# Altium schematic sheet Display.SchDoc: Display
size A4; SheetNumber: 4; SheetTotal: 5
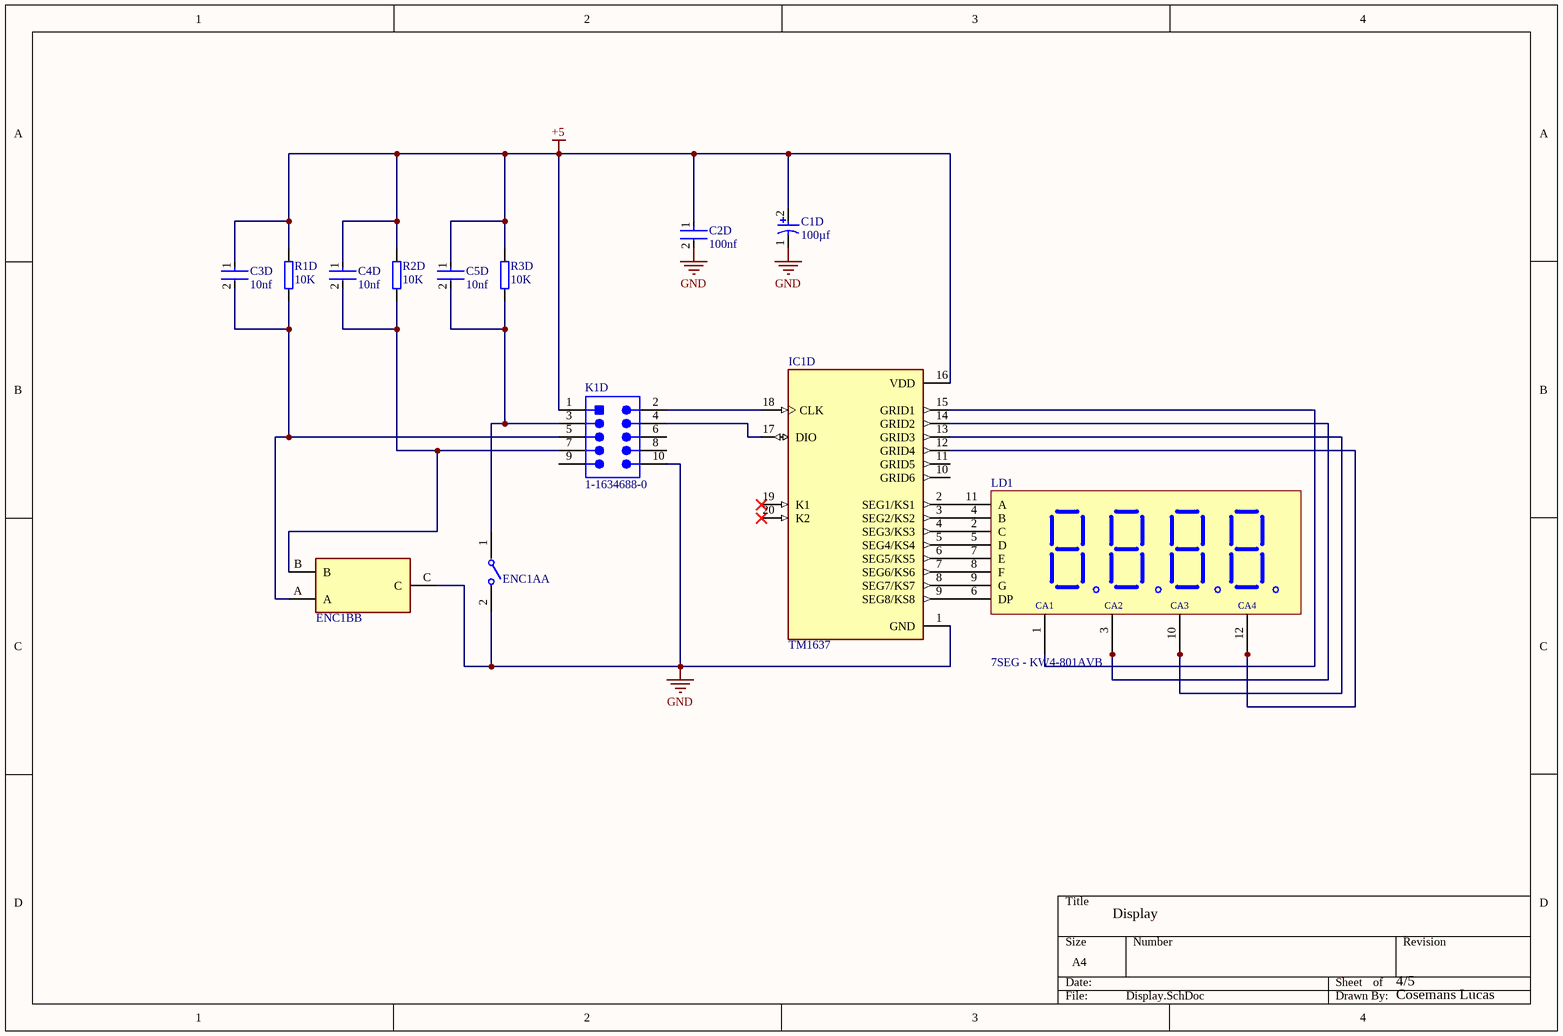
[diagram p0: Display.SchDoc]

## Parts
C1D  100µf  [CE_D6,3_L4,5]
C2D  100nf  [CC_0805_L]
C3D  10nf  [CC_0805_L]
C4D  10nf  [CC_0805_L]
C5D  10nf  [CC_0805_L]
ENC1A  PEC11R-4220F-S0012  [PEC11R_4220F_S0012]  (value not drawn)  (part A of 2)
ENC1B  PEC11R-4220F-S0012  [PEC11R_4220F_S0012]  (value not drawn)  (part B of 2)
IC1D  TM1637  [SOP_20_M]
K1D  1-1634688-0  [5x2 pin - TECO-1-1634688-0-10_V]
LD1  7SEG - KW4-801AVB  [7SEG - ELF-5125]
R1D  10K  [CC_0805_m]
R2D  10K  [R_0805_M]
R3D  10K  [R_0805_M]

## Nets
+5: C1D.2 C2D.1 C3D.1 C4D.1 C5D.1 IC1D.16(VDD) K1D.1 R1D.2 R2D.2 R3D.2
GND: C1D.1 C2D.2 ENC1A.2 ENC1B.C IC1D.1(GND) K1D.10
NetC3D_2: C3D.2 ENC1B.A K1D.5 R1D.1
NetC4D_2: C4D.2 ENC1B.B K1D.7 R2D.1
NetC5D_2: C5D.2 ENC1A.1 K1D.3 R3D.1
NetIC1D_2: IC1D.2(SEG1/KS1) LD1.11(A)
NetIC1D_3: IC1D.3(SEG2/KS2) LD1.4(B)
NetIC1D_4: IC1D.4(SEG3/KS3) LD1.2(C)
NetIC1D_5: IC1D.5(SEG4/KS4) LD1.5(D)
NetIC1D_6: IC1D.6(SEG5/KS5) LD1.7(E)
NetIC1D_7: IC1D.7(SEG6/KS6) LD1.8(F)
NetIC1D_8: IC1D.8(SEG7/KS7) LD1.9(G)
NetIC1D_9: IC1D.9(SEG8/KS8) LD1.6(DP)
NetIC1D_12: IC1D.12(GRID4) LD1.12
NetIC1D_13: IC1D.13(GRID3) LD1.10
NetIC1D_14: IC1D.14(GRID2) LD1.3
NetIC1D_15: IC1D.15(GRID1) LD1.1(CA1)
NetIC1D_17: IC1D.17(DIO) K1D.4
NetIC1D_18: IC1D.18(CLK) K1D.2

Not connected (* = marked no-connect by the designer): IC1D 10(GRID6) 11(GRID5) 19(K1)* 20(K2)*; K1D 6 8 9

## Notes on the sheet
- Display
- Cosemans Lucas
- (in symbol 7SEG - KW4-801AVB) CA2; CA3; CA4

## Library data of the parts
C1D = Capacitor_Electrolytic: Manufacturer: Panasonic; Voltage Rating: 25 V; ComponentLink2URL: http://industrial.panasonic.com/cdbs/www-data/pdf/RDE0000/ABA0000C1181.pdf; Height: 10.2 mm; Max Operating Temperature: 105 degC; PackageReference: EEE-FK1E221P; ComponentLink1Description: Manufacturer URL; ComponentLink1URL: http://www.panasonic.com/; Mount: Surface Mount; REACH SVHC: No SVHC; Min Operating Temperature: -55 degC; ComponentLink2Description: Datasheet; DatasheetVersion: 03/2016; Length: 10.2 mm; RoHSCompliant: true; Packaging: Tape and Reel; Package Quantity: 500; Lead Pitch: 3.1 mm; Pins: 2; PackageDescription: 2-Pin Electrolytic Aluminum Capacitor, Body 8.3 x 8.3 mm; Mounting Technology: Surface Mount
C2D C3D C4D C5D = Capacitor_Ceramic: Manufacturer: KEMET; Manufacturer Part Number: C0805C224K5RACTU; Value: 0.22 μF; Temperature Characteristic: X7R; Temperature Coefficient: 30ppm/°C; Tolerance: 0.1; Voltage Rating: 50 V; ComponentLink2URL: https://content.kemet.com/datasheets/KEM_C1003_C0G_SMD.pdf; Device Class L3: Ceramic Capacitors; Lead Free: Yes; Temperature: -55°C to +125°C; RoHS: TRUE; Capacitance: 0.22 μF; Automotive: No; Material: Ceramic; Octopart: https://octopart.com/c0805c224k5ractu-kemet-144670; Temperature Range Low: -55°C; Height: 0.88mm; Device Class L1: Passive Components; Digikey Description: CAP CER 0.22UF 50V X7R 0805; ComponentLink2Description: Datasheet; Mouser Description: CAP CER 0.22UF 50V X7R 0805; Category: Cap; Ipc Land Pattern Name: CAPC200125X78; Temperature Range High: +125°C; Package: C0805C-DN; Device Class L2: Capacitors
ENC1A ENC1B = PEC11R-4220F-S0012: ROTARY ENCODER MECHANICAL 12PPR; Built in Switch: Yes; Number of Channels: 2; Output Type: Quadrature; Hole Diameter: 7mm; Pulses per Revolution: 12; Termination: PC Pin; Package Quantity: 150; RoHS Compliant: Yes; Mount: Through Hole; Width: 12.5mm; Radiation Hardening: No; Number of Pins: 5; REACH SVHC: No SVHC; Type: Mechanical; Packaging: Bulk; Min Operating Temperature: -30°C; Encoder Type: Mechanical; Height: 13.4mm; Length: 26.5mm; Orientation: Vertical; Max Operating Temperature: 70°C; Series: PEC11R; Detent: Yes
IC1D = TM1637: LED Drive Control Special Circuit; MF: Titan Micro Electronics; Package: Package; Availability: Not in stock; SnapEDA_Link: https://www.snapeda.com/parts/TM1637/Titan+Micro+Electronics/view-part/?ref=snap; MP: TM1637; Check_prices: https://www.snapeda.com/parts/TM1637/Titan+Micro+Electronics/view-part/?ref=eda; Value: *; Price: None
K1D = 5x2 Pin: Male Header, Pitch 2.54 mm, 2 x 5 Postion, Height 9.15 mm, Tail Length 3.2 mm, -40 to 105 degC, RoHS, Bulk; Manufacturer: TE Connectivity; No. of Rows: 2; SVHC: ToBeAdvised; Package Version: Rev. C2, 02/2011; No. of Contacts: 10Contacts; Pitch: 2.54mm; No. of Positions: 10; Contact Termination Type: ThroughHole; Package Description: 10-Pin Connector, Body 20.35 x 8.7 mm, Pitch 2.54 mm; Orientation: Straight; Gender: Header; Mounting Technology: ThroughHole; Product Range: -; PartNumber: 1-1634688-0; Datasheet Version: Rev. C2, 02/2011; Contact Material: Brass; Package URL: https://datasheet.ciiva.com/6831/eng-cd-1634688-c2-6831201.pdf; Package Reference: 1-1634688-0; Pitch Spacing: 2.54mm; Contact Plating: GoldPlatedContacts; Manufacturer URL: http://www.te.com/; Datasheet URL: https://datasheet.ciiva.com/6831/eng-cd-1634688-c2-6831201.pdf
LD1 = 7SEG - KW4-801AVB: 4-Digit LED Display
R1D R2D R3D = Resistor: Manufacturer: Vishay Dale; Part Number: CRCW08050000Z0EA